# Altium schematic sheet STC12C5A_LQFP44_Mini.SchDoc
size A4
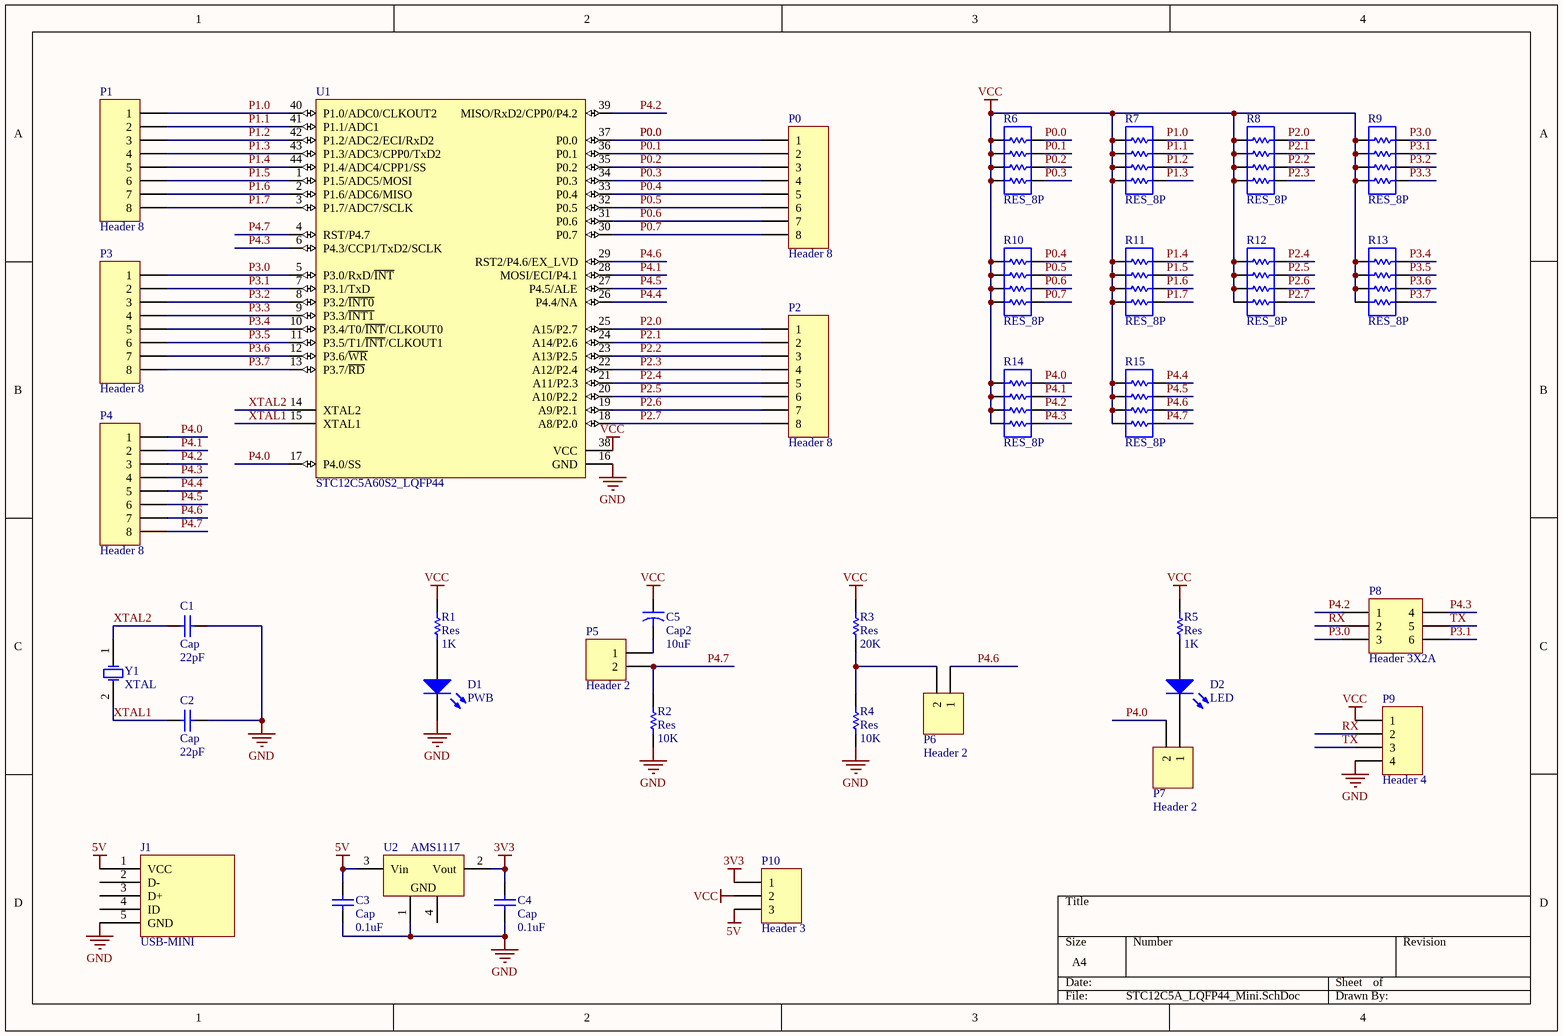
[diagram p0: STC12C5A_LQFP44_Mini.SchDoc]

## Parts
C1  Cap  value 22pF  [C0805]
C2  Cap  value 22pF  [C0805]
C3  Cap  value 0.1uF  [C0805]
C4  Cap  value 0.1uF  [C0805]
C5  Cap2  value 10uF  [CAP-4.2]
D1  PWB  [C0805]
D2  LED  [C0805]
J1  USB-MINI  [USB-MINI-A-SM]
P0  Header 8  [HDR1X8]
P1  Header 8  [HDR1X8]
P2  Header 8  [HDR1X8]
P3  Header 8  [HDR1X8]
P4  Header 8  [HDR1X8]
P5  Header 2  [HDR1X2]
P6  Header 2  [HDR1X2]
P7  Header 2  [HDR1X2]
P8  Header 3X2A  [HDR2X3_CEN]
P9  Header 4  [HDR1X4]
P10  Header 3  [HDR1X3]
R1  Res  value 1K  [0805]
R2  Res  value 10K  [0805]
R3  Res  value 20K  [0805]
R4  Res  value 10K  [0805]
R5  Res  value 1K  [0805]
R6  RES_8P  [RES_8P_0603]
R7  RES_8P  [RES_8P_0603]
R8  RES_8P  [RES_8P_0603]
R9  RES_8P  [RES_8P_0603]
R10  RES_8P  [RES_8P_0603]
R11  RES_8P  [RES_8P_0603]
R12  RES_8P  [RES_8P_0603]
R13  RES_8P  [RES_8P_0603]
R14  RES_8P  [RES_8P_0603]
R15  RES_8P  [RES_8P_0603]
U1  STC12C5A60S2_LQFP44  [LQFP44]
U2  AMS1117  [SOT-223]
Y1  XTAL  [XTAL1]

## Nets
3V3: C4.2 P10.1 U2.2(Vout)
5V: C3.2 J1.1(VCC) P10.3 U2.3(Vin)
GND: C1.2 C2.2 C3.1 C4.1 D1.2(K) J1.5(GND) P9.4 R2.1 R4.1 U1.16(GND) U2.1(GND)
VCC: C5.1 P9.1 P10.2 R1.2 R3.2 R5.2 R6.1 R6.3 R6.5 R6.7 R7.1 R7.3 R7.5 R7.7 R8.1 R8.3 R8.5 R8.7 R9.1 R9.3 R9.5 R9.7 R10.1 R10.3 R10.5 R10.7 R11.1 R11.3 R11.5 R11.7 R12.1 R12.3 R12.5 R12.7 R13.1 R13.3 R13.5 R13.7 R14.1 R14.3 R14.5 R14.7 R15.1 R15.3 R15.5 R15.7 U1.38(VCC)
P0.0: P0.1 R6.2 U1.37(P0.0)
P0.1: P0.2 R6.4 U1.36(P0.1)
P0.2: P0.3 R6.6 U1.35(P0.2)
P0.3: P0.4 R6.8 U1.34(P0.3)
P0.4: P0.5 R10.2 U1.33(P0.4)
P0.5: P0.6 R10.4 U1.32(P0.5)
P0.6: P0.7 R10.6 U1.31(P0.6)
P0.7: P0.8 R10.8 U1.30(P0.7)
P1.0: P1.1 R7.2 U1.40(P1.0/ADC0/CLKOUT2)
P1.1: P1.2 R7.4 U1.41(P1.1/ADC1)
P1.2: P1.3 R7.6 U1.42(P1.2/ADC2/ECI/RxD2)
P1.3: P1.4 R7.8 U1.43(P1.3/ADC3/CPP0/TxD2)
P1.4: P1.5 R11.2 U1.44(P1.4/ADC4/CPP1/SS)
P1.5: P1.6 R11.4 U1.1(P1.5/ADC5/MOSI)
P1.6: P1.7 R11.6 U1.2(P1.6/ADC6/MISO)
P1.7: P1.8 R11.8 U1.3(P1.7/ADC7/SCLK)
P2.0: P2.1 R8.2 U1.25(A15/P2.7)
P2.1: P2.2 R8.4 U1.24(A14/P2.6)
P2.2: P2.3 R8.6 U1.23(A13/P2.5)
P2.3: P2.4 R8.8 U1.22(A12/P2.4)
P2.4: P2.5 R12.2 U1.21(A11/P2.3)
P2.5: P2.6 R12.4 U1.20(A10/P2.2)
P2.6: P2.7 R12.6 U1.19(A9/P2.1)
P2.7: P2.8 R12.8 U1.18(A8/P2.0)
P3.0: P3.1 P8.3 R9.2 U1.5(P3.0/RxD/~{INT})
P3.1: P3.2 P8.6 R9.4 U1.7(P3.1/TxD)
P3.2: P3.3 R9.6 U1.8(P3.2/~{INT0})
P3.3: P3.4 R9.8 U1.9(P3.3/~{INT1})
P3.4: P3.5 R13.2 U1.10(P3.4/T0/~{INT}/CLKOUT0)
P3.5: P3.6 R13.4 U1.11(P3.5/T1/~{INT}/CLKOUT1)
P3.6: P3.7 R13.6 U1.12(P3.6/~{WR})
P3.7: P3.8 R13.8 U1.13(P3.7/~{RD})
P4.0: P4.1 P7.2 R14.2 U1.17(P4.0/SS)
P4.1: P4.2 R14.4 U1.28(MOSI/ECI/P4.1)
P4.2: P4.3 P8.1 R14.6 U1.39(MISO/RxD2/CPP0/P4.2)
P4.3: P4.4 P8.4 R14.8 U1.6(P4.3/CCP1/TxD2/SCLK)
P4.4: P4.5 R15.2 U1.26(P4.4/NA)
P4.5: P4.6 R15.4 U1.27(P4.5/ALE)
P4.6: P4.7 P6.1 R15.6 U1.29(RST2/P4.6/EX_LVD)
P4.7: P4.8 P5.2 R2.2 R15.8 U1.4(RST/P4.7)
RX: P8.2 P9.2
TX: P8.5 P9.3
XTAL1: C2.1 U1.15(XTAL1) Y1.2(OSC2)
XTAL2: C1.1 U1.14(XTAL2) Y1.1(OSC1)
NetC5_2: C5.2 P5.1
NetD1_1: D1.1(A) R1.1
NetD2_1: D2.1(A) R5.1
NetD2_2: D2.2(K) P7.1
NetP6_2: P6.2 R3.1 R4.2

Not connected (* = marked no-connect by the designer): J1 2(D-) 3(D+) 4(ID); U2 4(GND)

## Library data of the parts
C1-C4 = Cap: Capacitor; Published: 8-Jun-2000; LatestRevisionDate: 17-Jul-2002; LatestRevisionNote: Re-released for DXP Platform.; PackageReference: RAD-0.3; Publisher: Altium Limited; PackageDescription: Radial Cap, Thru-Hole; 2 Leads; 0.3 in Pin Spacing
C5 = Cap2: Capacitor; Published: 23-Sep-2002; PackageReference: CAPR5-4X5; Publisher: Altium Limited; PackageDescription: Capacitor; 2 Leads
D1 D2 = LED-2P: 发光二极管
P0-P4 = Header 8: Header, 8-Pin; LatestRevisionDate: 17-Jul-2002; LatestRevisionNote: Re-released for DXP Platform.; Publisher: Altium Limited
P5-P7 = Header 2: Header, 2-Pin; LatestRevisionDate: 17-Jul-2002; LatestRevisionNote: Re-released for DXP Platform.; Publisher: Altium Limited
P8 = Header 3X2A: Header, 3-Pin, Dual row; LatestRevisionDate: 17-Jul-2002; LatestRevisionNote: Re-released for DXP Platform.; Publisher: Altium Limited
P9 = Header 4: Header, 4-Pin; LatestRevisionDate: 17-Jul-2002; LatestRevisionNote: Re-released for DXP Platform.; Publisher: Altium Limited
P10 = Header 3: Header, 3-Pin; LatestRevisionDate: 17-Jul-2002; LatestRevisionNote: Re-released for DXP Platform.; Publisher: Altium Limited
R1-R5 = Res: Resistor; Published: 8-Jun-2000; LatestRevisionDate: 17-Jul-2002; LatestRevisionNote: Re-released for DXP Platform.; PackageReference: AXIAL-0.3; Publisher: Altium Limited; PackageDescription: Axial Device, Thru-Hole; 2 Leads; 0.3 in Pin Spacing
R6-R15 = RES_8P: 贴片排阻
U1 = STC12C5A60S2_LQFP44: 增强型8051单片机
U2 = AMS1117: 低压稳压器-1A
Y1 = XTAL: Crystal Oscillator; Published: 8-Jun-2000; LatestRevisionDate: 17-Jul-2002; LatestRevisionNote: Re-released for DXP Platform.; PackageReference: R38; Publisher: Altium Limited; PackageDescription: Crystal, Thru-Hole; 2 Leads; Body 3.1 x 8.2 mm (Dia.xH)